# EAGLE design utilidong-butt-mk-1.0 (EAGLE 6.5.0)
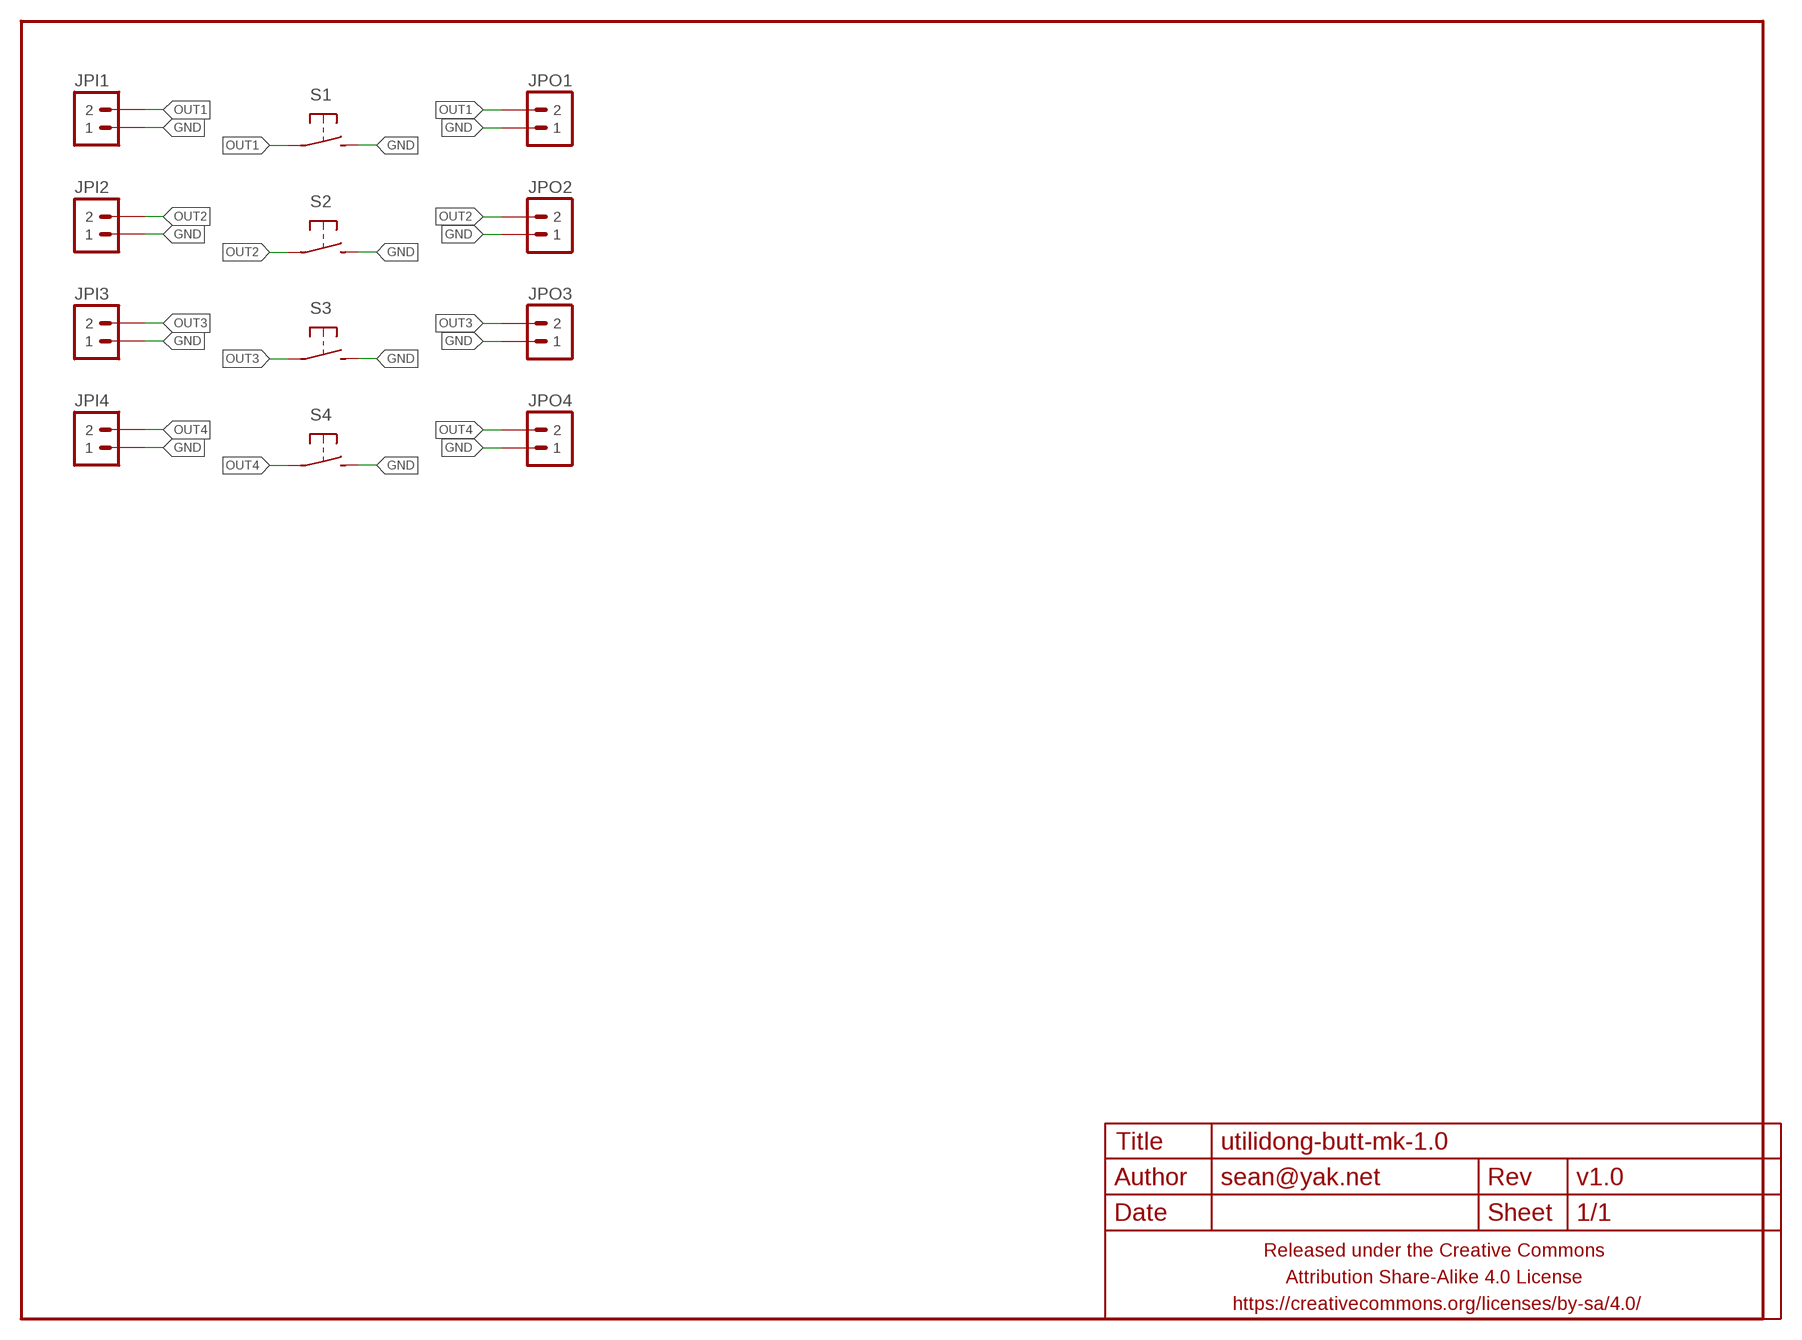
[diagram p0: schematic, sheet 1]

## Parts
FRAME1  FRAME-LETTERNO_PACKAGE  [DUMMY]
JPI1  M02PTH-CENTERED  [1X02-CENTER]
JPI2  M02PTH-CENTERED  [1X02-CENTER]
JPI3  M02PTH-CENTERED  [1X02-CENTER]
JPI4  M02PTH-CENTERED  [1X02-CENTER]
JPO1  M02PTH-CENTERED  [1X02-CENTER]
JPO2  M02PTH-CENTERED  [1X02-CENTER]
JPO3  M02PTH-CENTERED  [1X02-CENTER]
JPO4  M02PTH-CENTERED  [1X02-CENTER]
S1  SPST-NO-TACT6MM-PTH-SMALL-PADS  [DTS-6-SMALL-PADS]
S2  SPST-NO-TACT6MM-PTH-SMALL-PADS  [DTS-6-SMALL-PADS]
S3  SPST-NO-TACT6MM-PTH-SMALL-PADS  [DTS-6-SMALL-PADS]
S4  SPST-NO-TACT6MM-PTH-SMALL-PADS  [DTS-6-SMALL-PADS]

## Nets
GND: JPI1.1 JPI2.1 JPI3.1 JPI4.1 JPO1.1 JPO2.1 JPO3.1 JPO4.1 S1.3 S1.4 S2.3 S2.4 S3.3 S3.4 S4.3 S4.4
OUT1: JPI1.2 JPO1.2 S1.1 S1.2
OUT2: JPI2.2 JPO2.2 S2.1 S2.2
OUT3: JPI3.2 JPO3.2 S3.1 S3.2
OUT4: JPI4.2 JPO4.2 S4.1 S4.2

## Library data of the parts
FRAME1 = A_butts:FRAME-LETTER: Schematic Frame Standard 8.5x11 US Letter frame; DESIGNER: sean@yak.net; VERSION: v1.0
JPI1-JPI4 JPO1-JPO4 = A_butts:M02: Standard 2-pin 0.1" header. Use with - straight break away headers ( PRT-00116) - right angle break away headers (PRT-00553) - swiss pins (PRT-00743) - machine pins (PRT-00117) - female headers (PRT-00115) Molex polarized connector foot print use with: PRT-08233 with associated crimp pins and housings. 2.54_SCREWTERM for use with PRT-10571. 3.5mm Screw Terminal footprints for PRT-08084 5mm Screw Terminal footprints for use with PRT-08433
S1-S4 = A_butts:SPST-NO-TACT

## Board
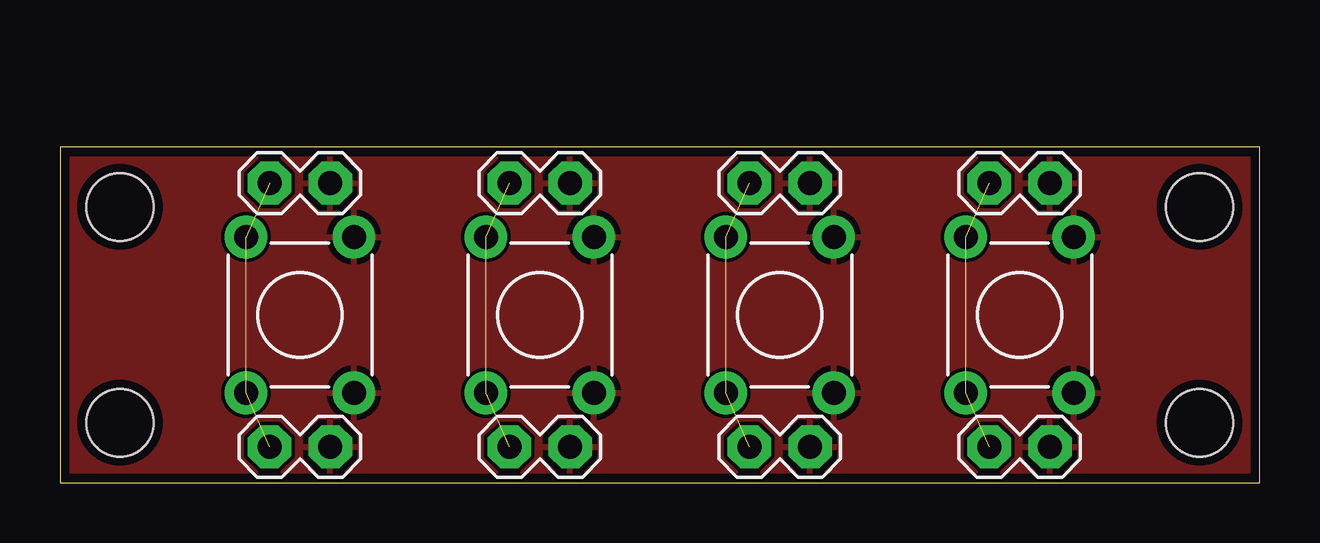
[diagram p1: board, top side]
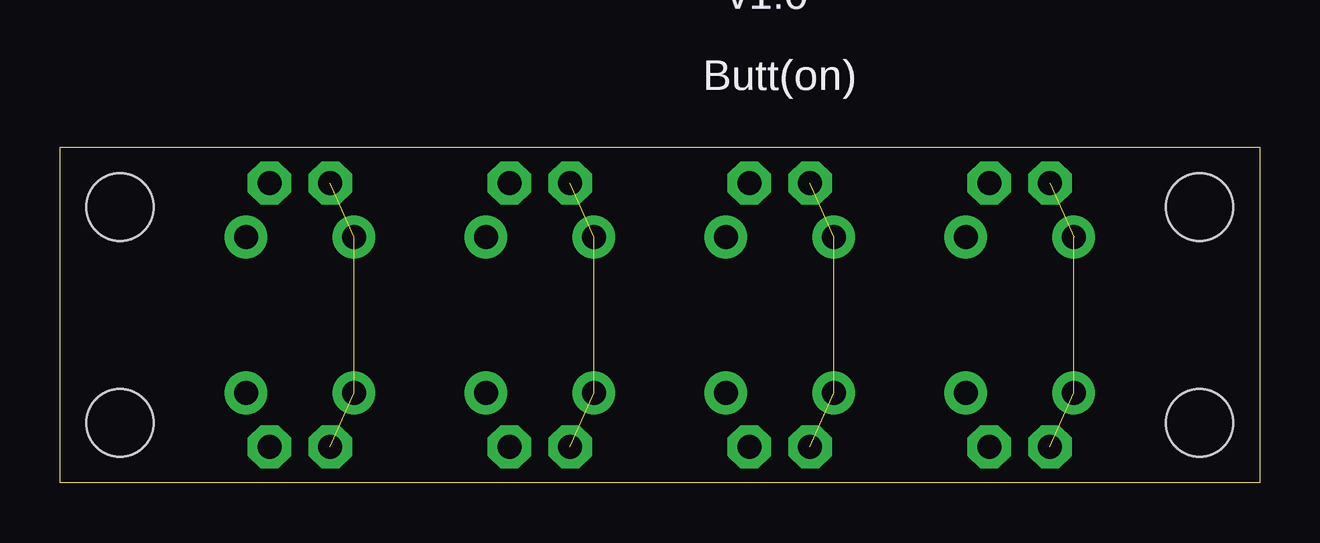
[diagram p2: board, bottom side, seen from below]

Size 50 x 14 mm. Coordinates in mm from the lower left corner, seen from the top.
Outline: 0,14 0,0 50,0 50,14 0,14
Copper layers (1*16): Top 0.0356mm / dielectric 1.5011mm / Bottom 0.0356mm
Design rules "LaenPCBOrder_2": minimum track width 6mil, minimum drill 13mil, track to track 6mil, track to pad 6mil, pad to pad 6mil, via to via 6mil, smd to smd 6mil, copper to edge 15mil, drill to drill 6mil, minimum pad ring 7mil, minimum via ring 7mil, stop-mask expansion 3mil, vias tented up to drill 20mil, thermal gap 10mil
Holes 2.8 mm at 2.5,11.5 2.5,2.5 47.5,11.5 47.5,2.5

### Footprints (pad centres in the part's own frame; a part is rotated, then mirrored left to right if it is on the bottom)
1X02-CENTER = drill 1 pad 1.8 octagon: 1 -1.27,0; 2 1.27,0
DTS-6-SMALL-PADS = drill 1 pad 1.778: 1 -3.25,2.25; 2 3.25,2.25; 3 -3.25,-2.25; 4 3.25,-2.25

### Placement (x,y rotation side)
FRAME1  0,0 0 top
JPI1  10,12.5 180 top
JPI2  20,12.5 180 top
JPI3  30,12.5 180 top
JPI4  40,12.5 180 top
JPO1  10,1.5 180 top
JPO2  20,1.5 180 top
JPO3  30,1.5 180 top
JPO4  40,1.5 180 top
S1  10,7 90 top
S2  20,7 90 top
S3  30,7 90 top
S4  40,7 90 top

### Tracks (layer width: path | path; a pad name or v marks a point on that pad's centre or on a via)
GND
  pour Top: 0,0 0,14 50,14 50,0
OUT1  (3 unrouted)
OUT2  (3 unrouted)
OUT3  (3 unrouted)
OUT4  (3 unrouted)

### Text on the board
Bottom: Butt(on)
bPlace: Butt(on)